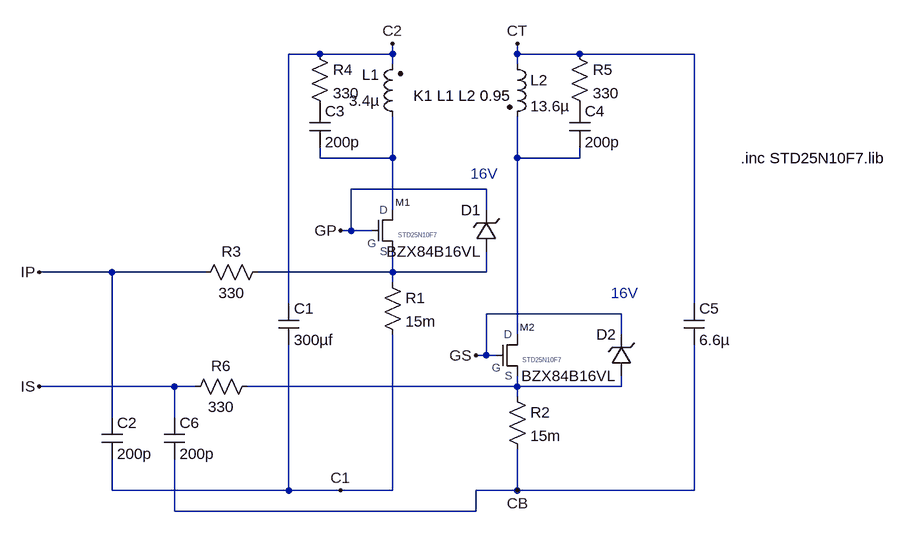
[diagram p0: schematic balanceModule.asc]
balanceModule.asc, the LTspice schematic file:
Version 4
SHEET 1 916 680
WIRE 64 -96 16 -96
WIRE 176 -96 176 -112
WIRE 176 -96 64 -96
WIRE 368 -96 368 -112
WIRE 464 -96 368 -96
WIRE 640 -96 464 -96
WIRE 176 -80 176 -96
WIRE 368 -80 368 -96
WIRE 64 64 64 48
WIRE 176 64 176 0
WIRE 176 64 64 64
WIRE 368 64 368 0
WIRE 464 64 464 48
WIRE 464 64 368 64
WIRE 320 112 112 112
WIRE 176 144 176 64
WIRE 320 144 320 112
WIRE 112 176 112 112
WIRE 112 176 96 176
WIRE 144 176 112 176
WIRE -256 240 -368 240
WIRE -112 240 -256 240
WIRE 176 240 176 208
WIRE 176 240 -32 240
WIRE 320 240 320 208
WIRE 320 240 176 240
WIRE 176 256 176 240
WIRE 16 288 16 -96
WIRE 640 288 640 -96
WIRE 528 304 320 304
WIRE 368 336 368 64
WIRE 528 336 528 304
WIRE 320 368 320 304
WIRE 320 368 304 368
WIRE 336 368 320 368
WIRE -160 416 -368 416
WIRE -128 416 -160 416
WIRE 368 416 368 400
WIRE 368 416 -48 416
WIRE 528 416 528 400
WIRE 528 416 368 416
WIRE 368 432 368 416
WIRE -256 464 -256 240
WIRE -160 464 -160 416
WIRE -256 576 -256 528
WIRE 16 576 16 352
WIRE 16 576 -256 576
WIRE 96 576 16 576
WIRE 176 576 176 336
WIRE 176 576 96 576
WIRE 368 576 368 512
WIRE 368 576 304 576
WIRE 640 576 640 352
WIRE 640 576 368 576
WIRE -160 608 -160 528
WIRE 304 608 304 576
WIRE 304 608 -160 608
FLAG 176 -112 C2
FLAG 368 -112 CT
FLAG 96 176 GP
FLAG 304 368 GS
FLAG 96 576 C1
FLAG 368 576 CB
FLAG -368 240 IP
FLAG -368 416 IS
SYMBOL ind2 192 16 R180
WINDOW 0 36 80 Left 2
WINDOW 3 36 40 Left 2
SYMATTR InstName L1
SYMATTR Value 3.4µ
SYMATTR Type ind
SYMATTR SpiceLine Ipk=10 Rser=10m
SYMBOL ind2 352 -96 R0
SYMATTR InstName L2
SYMATTR Value 13.6µ
SYMATTR Type ind
SYMATTR SpiceLine Ipk=10 Rser=40m
SYMBOL res 160 240 R0
SYMATTR InstName R1
SYMATTR Value 15m
SYMBOL res 352 416 R0
SYMATTR InstName R2
SYMATTR Value 15m
SYMBOL cap 0 288 R0
SYMATTR InstName C1
SYMATTR Value 300µf
SYMATTR SpiceLine Rser=50m
SYMBOL STD25N10F7 176 176 R0
SYMATTR InstName M1
SYMATTR Value ""
SYMATTR SpiceModel STD25N10F7
SYMBOL STD25N10F7 368 368 R0
SYMATTR InstName M2
SYMATTR Value ""
SYMATTR SpiceModel STD25N10F7
SYMBOL res 48 -112 R0
SYMATTR InstName R4
SYMATTR Value 330
SYMBOL res 448 -112 R0
SYMATTR InstName R5
SYMATTR Value 330
SYMBOL cap 48 -16 R0
SYMATTR InstName C3
SYMATTR Value 200p
SYMBOL cap 448 -16 R0
SYMATTR InstName C4
SYMATTR Value 200p
SYMBOL cap 624 288 R0
SYMATTR InstName C5
SYMATTR Value 6.6µ
SYMBOL zener 336 208 R180
WINDOW 0 24 64 Left 2
WINDOW 3 24 0 Left 2
SYMATTR InstName D1
SYMATTR Value BZX84B16VL
SYMATTR Description Diode
SYMATTR Type diode
SYMBOL zener 544 400 R180
WINDOW 0 24 64 Left 2
WINDOW 3 24 0 Left 2
SYMATTR InstName D2
SYMATTR Value BZX84B16VL
SYMATTR Description Diode
SYMATTR Type diode
SYMBOL res -16 224 R90
WINDOW 0 0 56 VBottom 2
WINDOW 3 32 56 VTop 2
SYMATTR InstName R3
SYMATTR Value 330
SYMBOL res -32 400 R90
WINDOW 0 0 56 VBottom 2
WINDOW 3 32 56 VTop 2
SYMATTR InstName R6
SYMATTR Value 330
SYMBOL cap -272 464 R0
SYMATTR InstName C2
SYMATTR Value 200p
SYMBOL cap -176 464 R0
SYMATTR InstName C6
SYMATTR Value 200p
TEXT 208 -32 Left 2 !K1 L1 L2 0.95
TEXT 712 64 Left 2 !.inc STD25N10F7.lib
TEXT 296 88 Left 2 ;16V
TEXT 512 272 Left 2 ;16V

The netlist it stands for:
* balanceModule.asc
L1 N001 C2 3.4µ Ipk=10 Rser=10m
L2 CT N002 13.6µ Ipk=10 Rser=40m
R1 N003 C1 15m
R2 N004 CB 15m
C1 C2 C1 300µf Rser=50m
XM1 N001 GP N003 STD25N10F7  ; pins D G S
XM2 N002 GS N004 STD25N10F7  ; pins D G S
R4 C2 P001 330
R5 CT P002 330
C3 P001 N001 200p
C4 P002 N002 200p
C5 CT CB 6.6µ
D1 N003 GP BZX84B16VL
D2 N004 GS BZX84B16VL
R3 N003 IP 330
R6 N004 IS 330
C2 IP C1 200p
C6 IS CB 200p
.model D D
.lib standard.dio
K1 L1 L2 0.95
.inc STD25N10F7.lib
* 16V
* 16V
.lib STD25N10F7.lib
.backanno
.end